# EAGLE design carlight_schematic (EAGLE 9.5.1)
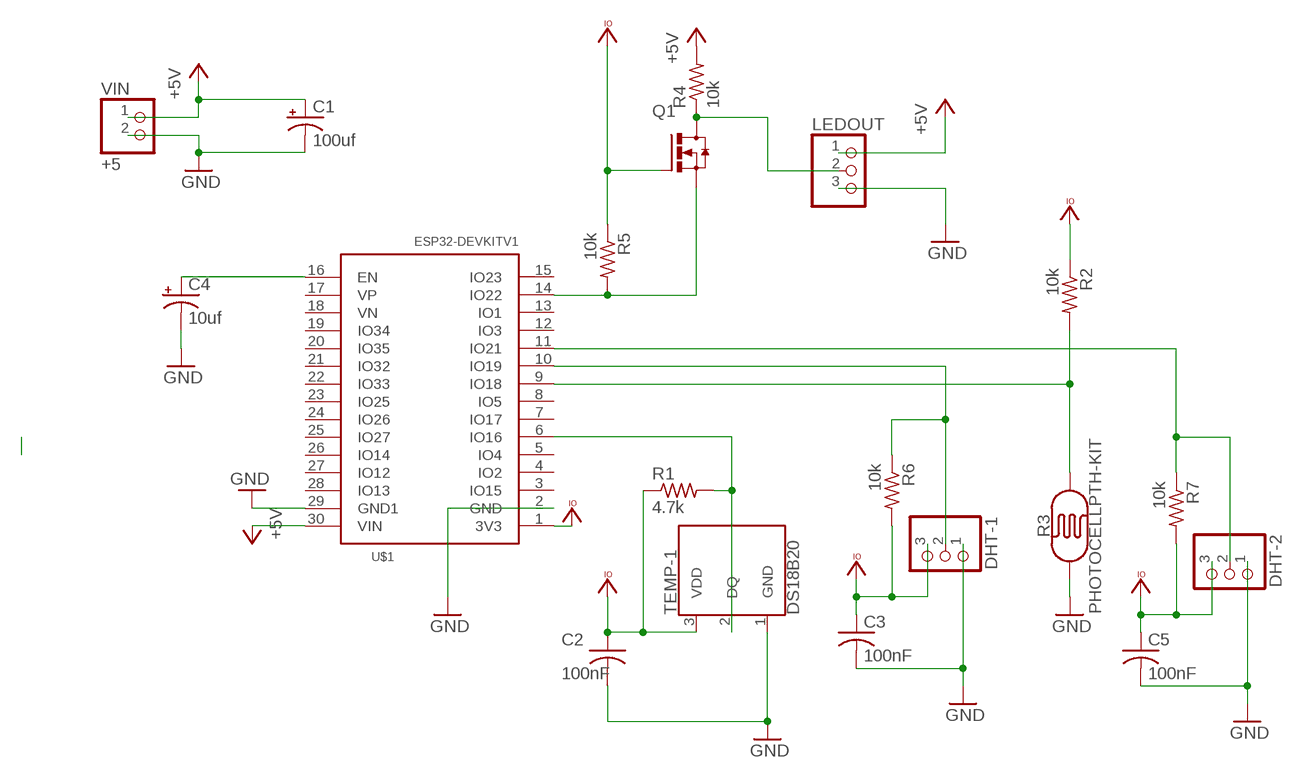
[diagram p0: schematic, sheet 1]

## Parts
C1  100uf  CPOL-US153CLV-0605  [153CLV-0605]
C2  100nF  C-USC0805  [C0805]
C3  100nF  C-USC0805  [C0805]
C4  10uf  CPOL-US153CLV-0605  [153CLV-0605]
C5  100nF  C-USC0805  [C0805]
DHT-1  PINHD-1X3  [1X03]
DHT-2  PINHD-1X3  [1X03]
LEDOUT  PINHD-1X3  [1X03]
Q1  2N7002  2N7002,215  [SOT23-3]
R1  4.7k  R-US_R0805  [R0805]
R2  10k  R-US_R0805  [R0805]
R3  PHOTOCELLPTH-KIT  [PHOTOCELL-KIT]
R4  10k  R-US_R0805  [R0805]
R5  10k  R-US_R0805  [R0805]
R6  10k  R-US_R0805  [R0805]
R7  10k  R-US_R0805  [R0805]
TEMP-1  DS18B20  [TO-92-AMMO]
U$1  ESP32DEVKITV1  [ESP32-DEVKITV1]
VIN  +5  PINHD-1X2  [1X02]

## Nets
+5V: C1.+ LEDOUT.1 R4.2 U$1.30(VIN) VIN.1
GND: C1.- C2.2 C3.2 C4.- C5.2 DHT-1.1 DHT-2.1 LEDOUT.3 R3.1 TEMP-1.1(GND) U$1.2(GND) U$1.29(GND1) VIN.2
N$2: Q1.2(S) R5.2 U$1.14(IO22)
N$3: R1.2 TEMP-1.2(DQ) U$1.6(IO16)
N$5: LEDOUT.2 Q1.3(D) R4.1
N$6: R2.2 R3.2 U$1.9(IO18)
N$7: C4.+ U$1.16(EN)
N$8: DHT-2.2 R7.1 U$1.11(IO21)
N$9: DHT-1.2 R6.1 U$1.10(IO19)
VCCIO: C2.1 C3.1 C5.1 DHT-1.3 DHT-2.3 Q1.1(G) R1.1 R2.1 R5.1 R6.2 R7.2 TEMP-1.3(VDD) U$1.1(3V3)
Unconnected: U$1.3(IO15) U$1.4(IO2) U$1.5(IO4) U$1.7(IO17) U$1.8(IO5) U$1.12(IO3) U$1.13(IO1) U$1.15(IO23) U$1.17(VP) U$1.18(VN) U$1.19(IO34) U$1.20(IO35) U$1.21(IO32) U$1.22(IO33) U$1.23(IO25) U$1.24(IO26) U$1.25(IO27) U$1.26(IO14) U$1.27(IO12) U$1.28(IO13)

## Library data of the parts
C1 C4 = resistor:CPOL-US: POLARIZED CAPACITOR, American symbol
C2 C3 C5 = resistor:C-US: CAPACITOR, American symbol
DHT-1 DHT-2 LEDOUT = pinhead:PINHD-1X3: PIN HEADER
Q1 = Transistor:2N7002,215: MOSFET N-CH 60V 300MA SOT-23 Manufacturer's datasheet <https://assets.nexperia.com/documents/data-sheet/2N7002.pdf>; CREATED_BY: PCBLayout.com; DIGIKEY_PART_NUMBER: 1727-2764-1-ND; MANUFACTURER: Nexperia USA Inc.; MPN: 2N7002,215; PACKAGE: SOT-23-3
R1 R2 = resistor:R-US_: RESISTOR, American symbol
R3 = SparkFun-Sensors:PHOTOCELL: Photocell (Photodetector, Photo Resistor, CdS) This is a very small light sensor. A photocell changes (also called a photodetector, photo resistor, CdS or photoconductive cell) resistance depending on the amount of light it is exposed to. These little sensors make great ambient light triggers (when light in the room turns on, do something). Datasheet <http://cdn.sparkfun.com/datasheets/Sensors/LightImaging/SEN-09088.pdf> SparkFun Products Mini Photocell <https://www.sparkfun.com/products/9088> (SEN-09088); PROD_ID: COMP-09129; SF_ID: SEN-09088
R4-R7 = adafruit:R-US_: RESISTOR, American symbol
TEMP-1 = SparkFun-Sensors:DS18B20: Dallas/Maxim DS18B20 1-Wire Temperature Sensor The DS18B20 reports degrees C with 9 to 12-bit precision, -55C to 125C (+/-0.5C). Each sensor has a unique 64-Bit Serial number etched into it - allows for a huge number of sensors to be used on one data bus. Datasheet <http://datasheets.maximintegrated.com/en/ds/DS18B20.pdf> SparkFun Products One Wire Digital Temperature Sensor - DS18B20 <https://www.sparkfun.com/products/245> (SEN-00245); STORE_ID: SEN-00245
U$1 = ESP32-DEVKITV1:ESP32DEVKITV1
VIN = pinhead:PINHD-1X2: PIN HEADER

## Board
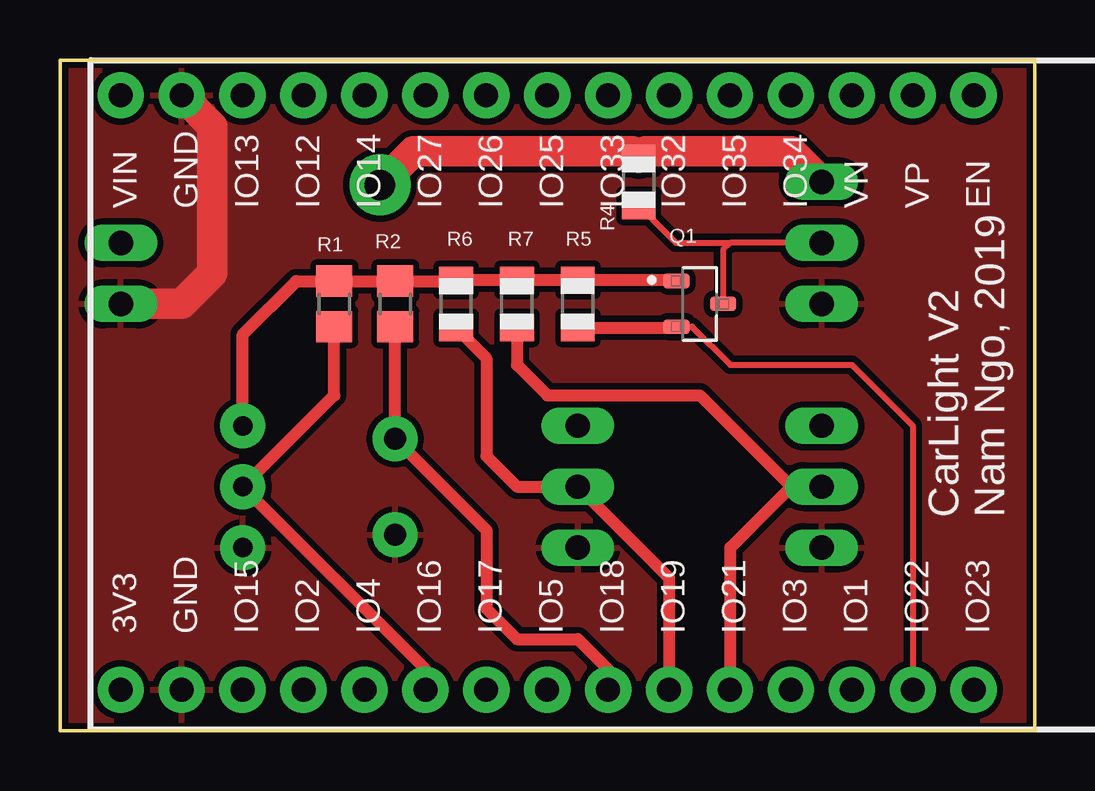
[diagram p1: board, top side]
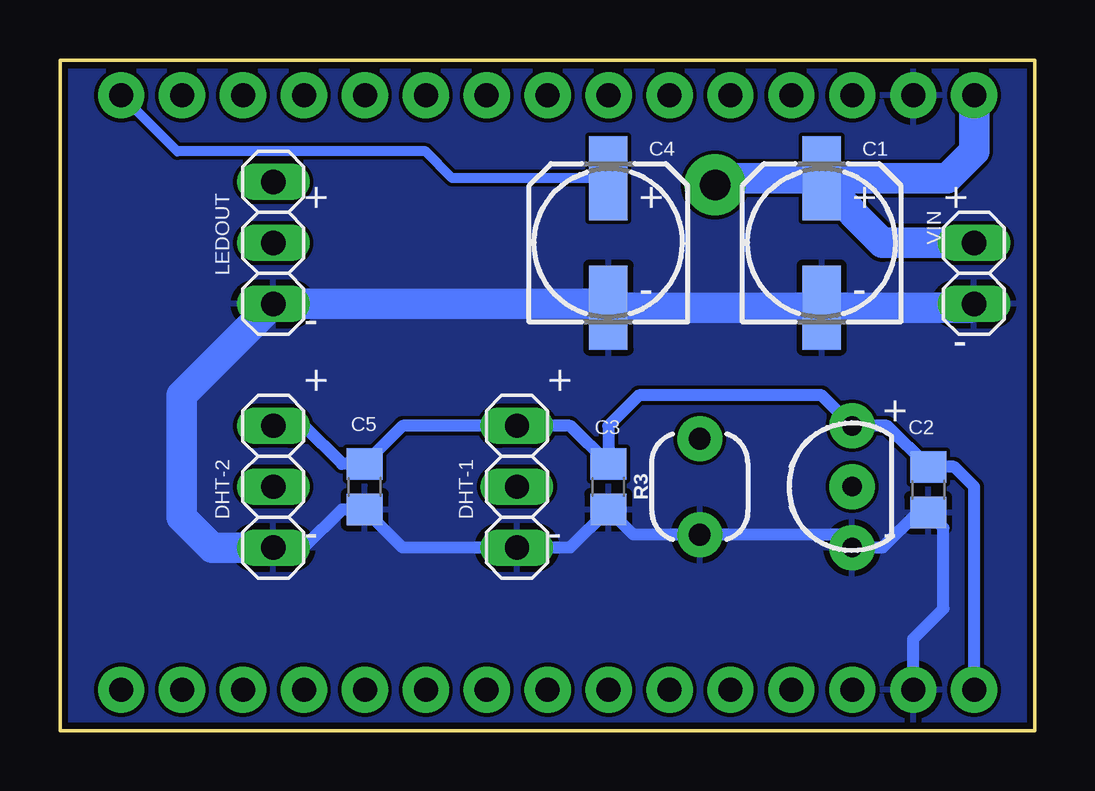
[diagram p2: board, bottom side, seen from below]

Size 40.64 x 27.94 mm. Coordinates in mm from the lower left corner, seen from the top.
Outline: 40.64,0 40.64,27.94 0,27.94 0,0 40.64,0
Copper layers (1*16): Top 0.035mm / dielectric 1.5mm / Bottom 0.035mm
Design rules "dirt_cheap_dirty_boards.v1.1": minimum track width 6mil, minimum drill 12mil, track to track 6mil, track to pad 6mil, pad to pad 6mil, via to via 6mil, smd to smd 0mil, copper to edge 10mil, drill to drill 10mil, minimum pad ring 10mil, minimum via ring 6mil, stop-mask expansion 2mil, vias tented up to drill 25mil, thermal gap 10mil

### Footprints (pad centres in the part's own frame; a part is rotated, then mirrored left to right if it is on the bottom)
153CLV-0605 = smd 3.5 x 1.6: + 2.7,0; - -2.7,0
C0805 = smd 1.3 x 1.5: 1 -0.95,0; 2 0.95,0
1X03 = drill 1.016 long: 1 -2.54,0; 2 0,0; 3 2.54,0
SOT23-3 = smd 0.62 x 1.1: 1 -0.95,-0.975; 2 0.95,-0.975; 3 0,0.975
R0805 = smd 1.3 x 1.5: 1 -0.95,0; 2 0.95,0
PHOTOCELL-KIT = drill 0.9 pad 1.88: 1 -2,0; 2 2,0
R0805' = smd 1.1 x 1.4: 1 -1,0; 2 1,0
TO-92-AMMO = drill 0.813 pad 1.88: 1 -2.54,0; 2 0,0; 3 2.54,0
ESP32-DEVKITV1 = drill 1 pad 1.93: 1 -22.87,-13.54; 2 -20.33,-13.54; 3 -17.79,-13.54; 4 -15.25,-13.54; 5 -12.71,-13.54; 6 -10.17,-13.54; 7 -7.63,-13.54; 8 -5.09,-13.54; 9 -2.55,-13.54; 10 -0.01,-13.54; 11 2.53,-13.54; 12 5.07,-13.54; 13 7.61,-13.54; 14 10.15,-13.54; 15 12.69,-13.54; 16 12.69,11.23; 17 10.15,11.23; 18 7.61,11.23; 19 5.07,11.23; 20 2.53,11.23; 21 -0.01,11.23; 22 -2.55,11.23; 23 -5.09,11.23; 24 -7.63,11.23; 25 -10.17,11.23; 26 -12.71,11.23; 27 -15.25,11.23; 28 -17.79,11.23; 29 -20.33,11.23; 30 -22.87,11.23
1X02 = drill 1.016 long: 1 -1.27,0; 2 1.27,0

### Placement (x,y rotation side)
C1  8.89,20.32 90 bottom
C2  4.45,10.03 270 bottom
C3  17.78,10.16 270 bottom
C4  17.78,20.32 90 bottom
C5  27.94,10.16 270 bottom
DHT-1  21.59,10.16 90 bottom
DHT-2  31.75,10.16 90 bottom
LEDOUT  31.75,20.32 270 bottom
Q1  26.67,17.78 270 top
R1  11.43,17.78 270 top
R2  13.97,17.78 270 top
R3  13.97,10.16 90 bottom
R4  10k  [R0805']  24.13,22.86 90 top
R5  10k  [R0805']  21.59,17.78 270 top
R6  10k  [R0805']  16.51,17.78 90 top
R7  10k  [R0805']  19.05,17.78 90 top
TEMP-1  7.62,10.16 90 bottom
U$1  25.4,15.24 0 top
VIN  2.54,19.05 270 bottom

### Tracks (layer width: path | path; a pad name or v marks a point on that pad's centre or on a via)
+5V  (via drill 1.27 pad 2.54)
  Top 1.27: LEDOUT.1 30.48,24.13 24.4,24.13 R4.2 23.86,24.13 14.73,24.13 v13.34,22.73
  Bottom 1.27: VIN.1 6.35,20.32 8.89,22.86 C1.+ | C1.+ 3.65,23.02 2.53,24.14 U$1.30 | C1.+ 13.05,23.02 v13.34,22.73
GND
  Top 1.27: U$1.29 6.35,25.19 6.35,19.05 5.08,17.78 VIN.2
  Bottom 0.508: DHT-2.1 30.48,7.62 28.89,9.21 C5.2 26.35,7.62 DHT-1.1 19.37,7.62 C3.2 16.73,8.16 R3.1 8.16,8.16 TEMP-1.1 6.35,7.62 4.89,9.08 C2.2 3.81,8.45 3.81,5.08 5.07,3.82 U$1.2
  Bottom 1.27: VIN.2 2.7,17.62 C1.- C4.- 17.94,17.78 LEDOUT.3 35.56,13.97 35.56,8.89 34.29,7.62 DHT-2.1
  pour Bottom: 0,27.94 40.64,27.94 40.64,0 0,0
  pour Top (isolate 0.254): 0,27.94 40.64,27.94 40.64,0 0,0
N$2
  Top 0.254: Q1.2 26.35,16.83 27.94,15.24 33.02,15.24 35.55,12.71 U$1.14
  Top 0.508: R5.2 25.65,16.78 Q1.2
N$3
  Top 0.508: U$1.6 15.23,2.55 TEMP-1.2 11.43,13.97 R1.2
N$5
  Top 0.254: LEDOUT.2 27.94,20.32 | 27.94,20.32 27.65,20.03 Q1.3 | R4.1 25.67,20.32 27.94,20.32
N$6
  Top 0.508: R2.2 R3.2 17.78,8.35 17.78,5.08 19.05,3.81 21.59,3.81 22.85,2.55 U$1.9
N$7
  Bottom 0.406: C4.+ 24.29,23.02 25.4,24.13 35.75,24.13 U$1.16
N$8
  Top 0.508: R7.1 19.05,15.24 20.32,13.97 26.67,13.97 30.48,10.16 | U$1.11 27.94,7.62 30.48,10.16 | 30.48,10.16 DHT-2.2
N$9
  Top 0.508: U$1.10 25.39,6.36 DHT-1.2 19.05,10.16 17.78,11.43 17.78,15.51 R6.1
VCCIO
  Top 0.508: TEMP-1.3 7.62,16.51 9.84,18.73 R1.1 R2.1 16.46,18.73 R6.2 R7.2 R5.1 25.65,18.78 Q1.1
  Bottom 0.508: DHT-2.3 30.48,12.7 28.89,11.11 C5.1 26.35,12.7 DHT-1.3 19.37,12.7 C3.1 17.78,12.7 16.51,13.97 8.89,13.97 TEMP-1.3 6.16,12.7 C2.1 3.36,10.98 2.53,10.15 U$1.1

### Text on the board
tPlace: CarLight V2 / Nam Ngo, 2019
bPlace: + | + | + | + | - | - | - | - | + | + | + | - | - | -